# Altium project MB1641.PrjPcb (part 2 of 2)

## Sheet STLINK_V2-1.SCHDOC: STLink V2-1
size A4; Author: Ph.A; SheetNumber: 7; SheetTotal: 8
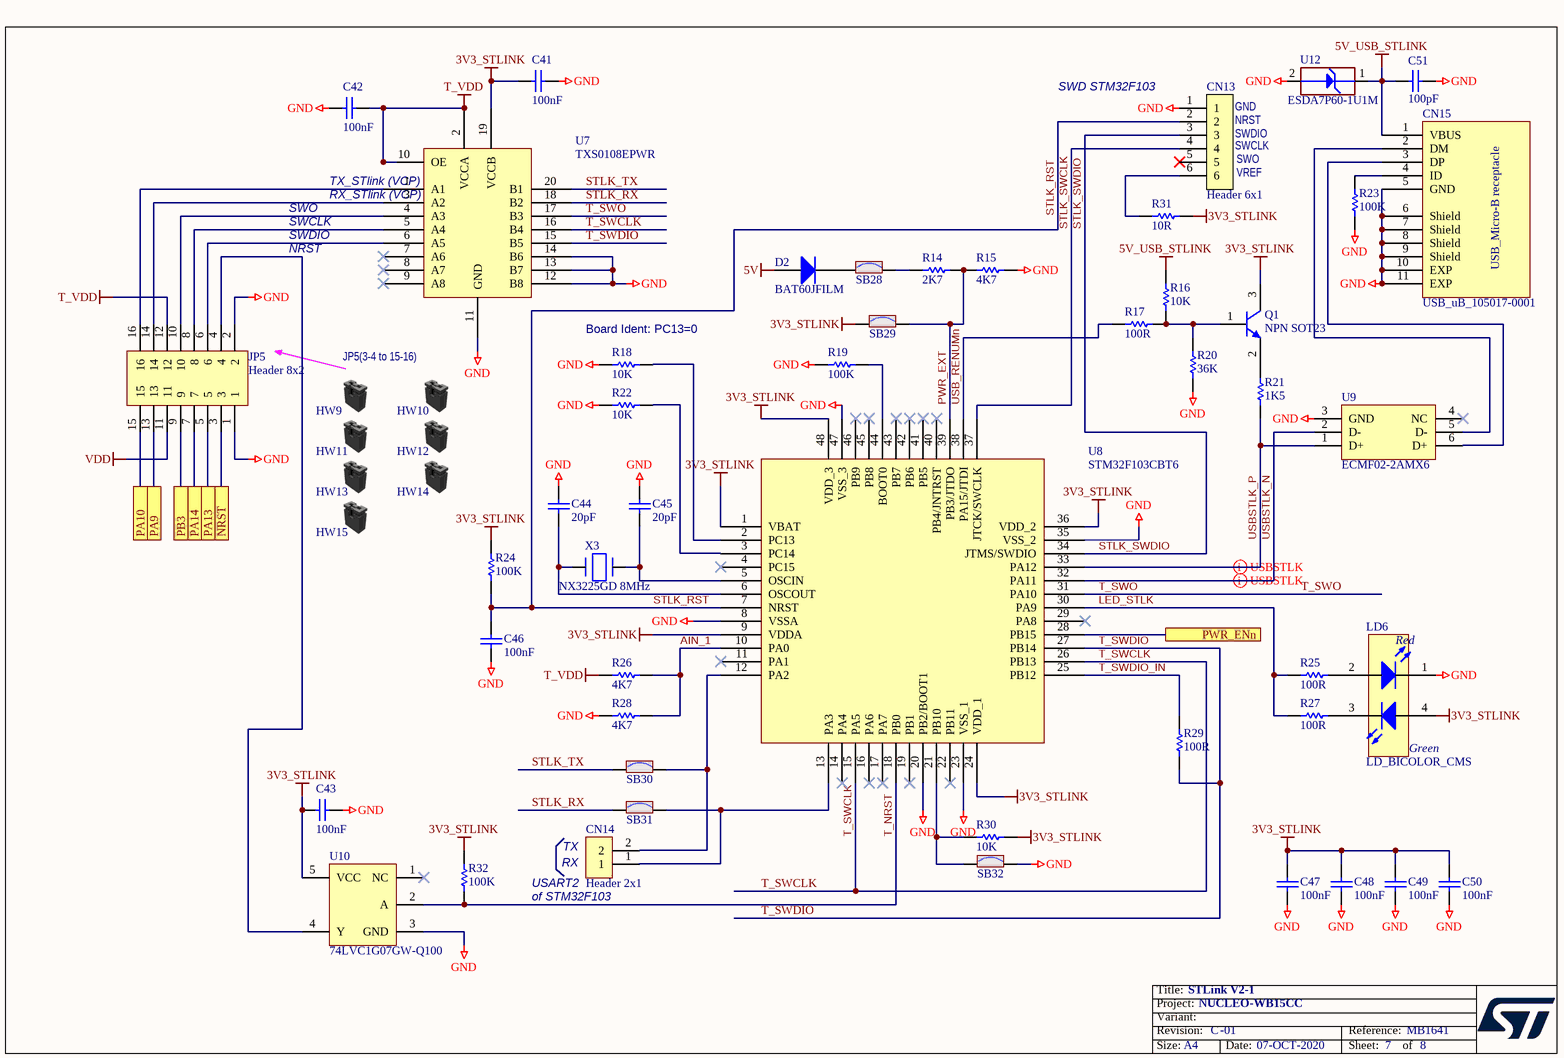
[diagram p4: STLINK_V2-1.SCHDOC]

### Parts
C41  value 100nF  [C0402]  (hidden comment: Capacitor)
C42  value 100nF  [C0402]  (hidden comment: Capacitor)
C43  value 100nF  [C0402]  (hidden comment: Capacitor)
C44  value 20pF  [C0402]  (hidden comment: Capacitor)
C45  value 20pF  [C0402]  (hidden comment: Capacitor)
C46  value 100nF  [C0402]  (hidden comment: Capacitor)
C47  value 100nF  [C0402]  (hidden comment: Capacitor)
C48  value 100nF  [C0402]  (hidden comment: Capacitor)
C49  value 100nF  [C0402]  (hidden comment: Capacitor)
C50  value 100nF  [C0402]  (hidden comment: Capacitor)
C51  value 100pF  [C0402]  (hidden comment: Capacitor)
CN13  Header 6x1  [CON_SAMTEC_TSW-106-07-X-S]
CN14  Header 2x1  [CON_SAMTEC_TSW-102-07-G-S]
CN15  value USB_uB_105017-0001  [CON_USBMICROB_MOLEX_105017-0001_H2P90]  (hidden comment: USB_uB_105017.0001)
D2  BAT60JFILM  [DIO_SOD323]
HW9  Shunt Black 2.54mm  (value not drawn)  (mechanical)
HW10  Shunt Black 2.54mm  (value not drawn)  (mechanical)
HW11  Shunt Black 2.54mm  (value not drawn)  (mechanical)
HW12  Shunt Black 2.54mm  (value not drawn)  (mechanical)
HW13  Shunt Black 2.54mm  (value not drawn)  (mechanical)
HW14  Shunt Black 2.54mm  (value not drawn)  (mechanical)
HW15  Shunt Black 2.54mm  (value not drawn)  (mechanical)
JP5  Header 8x2  [CON_SAMTEC_TSW-108-07-X-D]
LD6  LD_BICOLOR_CMS  [LED_BI-GR_HSMF-A201-A00J1]
Q1  value NPN SOT23  [NPN_SOT23]  (hidden comment: 9013-SOT23)
R14  value 2K7  [R0402]  (hidden comment: Resistor)
R15  value 4K7  [R0402]  (hidden comment: Resistor)
R16  value 10K  [R0402]  (hidden comment: Resistor)
R17  value 100R  [R0402]  (hidden comment: Resistor)
R18  value 10K  [R0402]  (hidden comment: Resistor)
R19  value 100K  [R0402]  (hidden comment: Resistor)
R20  value 36K  [R0402]  (hidden comment: Resistor)
R21  value 1K5  [R0402]  (hidden comment: Resistor)
R22  value 10K  [R0402]  (hidden comment: Resistor)
R23  value 100K  [R0402]  (hidden comment: Resistor)
R24  value 100K  [R0402]  (hidden comment: Resistor)
R25  value 100R  [R0402]  (hidden comment: Resistor)
R26  value 4K7  [R0402]  (hidden comment: Resistor)
R27  value 100R  [R0402]  (hidden comment: Resistor)
R28  value 4K7  [R0402]  (hidden comment: Resistor)
R29  value 100R  [R0402]  (hidden comment: Resistor)
R30  value 10K  [R0402]  (hidden comment: Resistor)
R31  value 10R  [R0402]  (hidden comment: Resistor)
R32  value 100K  [R0402]  (hidden comment: Resistor)
SB28  SB_ON  [SOLDER-BRIDGE_R0402-0R]  (value not drawn)
SB29  SB_ON  [SOLDER-BRIDGE_R0402-0R]  (value not drawn)
SB30  SB_ON  [SOLDER-BRIDGE_R0402-0R]  (value not drawn)
SB31  SB_ON  [SOLDER-BRIDGE_R0402-0R]  (value not drawn)
SB32  SB_ON  [SOLDER-BRIDGE_R0402-0R]  (value not drawn)
U7  TXS0108EPWR  [ICC_TSSOP20_6P50X4P40_P065]
U8  STM32F103CBT6  [ICC_LQFP48_7X7_P050]
U9  ECMF02-2AMX6  [ESD_QFN-6L_1P7X1P5_P050]
U10  74LVC1G07GW-Q100  [ICC_TSSOP5_SOT353-1_2P05X1P25_P065]
U12  value ESDA7P60-1U1M  [ESD_QFN2_1P6X1_P125]  (hidden comment: ESD-TRANSIL)
X3  value NX3225GD 8MHz  [CRY_NX3225GD_2P]  (hidden comment: XTAL_2_PINS)

### Ports
NRST, PA9, PA10, PA13, PA14, PB3, PWR_ENn

### Nets
3V3_STLINK: C41.1 C43.1 C47.2 C48.2 C49.2 C50.2 LD6.4(YellowGreen_anode) Q1.3(C) R24.2 R30.1 R31.2 R32.2 SB29.1 U7.19(VCCB) U8.1(VBAT) U8.9(VDDA) U8.24(VDD_1) U8.36(VDD_2) U8.48(VDD_3) U10.5(VCC)
5V: D2.1(A)
5V_USB_STLINK: C51.1 CN15.1(VBUS) R16.2 U12.1(IO1)
GND: C41.2 C42.1 C43.2 C44.2 C45.2 C46.1 C47.1 C48.1 C49.1 C50.1 C51.2 CN13.1 CN15.5(GND) CN15.6(Shield) CN15.7(Shield) CN15.8(Shield) CN15.9(Shield) CN15.10(EXP) CN15.11(EXP) JP5.1 JP5.2 LD6.1(RED_cathode) R15.2 R18.2 R19.2 R20.1 R22.2 R23.1 R28.1 SB32.2 U7.11(GND) U7.12(B8) U7.13(B7) U7.14(B6) U8.8(VSSA) U8.20(PB2/BOOT1) U8.23(VSS_1) U8.35(VSS_2) U8.47(VSS_3) U9.3(GND) U10.3(GND) U12.2(GND)
T_VDD: C42.2 JP5.12 R26.1 U7.2(VCCA) U7.10(OE)
VDD: JP5.11
AIN_1: R26.2 R28.2 U8.10(PA0)
LED_STLK: R25.1 R27.1 U8.30(PA9)
NRST: JP5.3 ; port NRST
PA9: JP5.13 ; port PA9
PA10: JP5.15 ; port PA10
PA13: JP5.5 ; port PA13
PA14: JP5.7 ; port PA14
PB3: JP5.9 ; port PB3
PWR_ENn: U8.28(PB15) ; port PWR_ENn
PWR_EXT: R14.2 R15.1 SB29.2 U8.39(PB3/JTDO)
STLK_RST: C46.2 CN13.2 R24.1 U8.7(NRST)
STLK_RX: SB31.1 U7.18(B2)
STLK_SWCLK: CN13.4 U8.37(JTCK/SWCLK)
STLK_SWDIO: CN13.3 U8.34(JTMS/SWDIO)
STLK_TX: SB30.1 U7.20(B1)
T_NRST: R32.1 U8.18(PB0) U10.2(A)
T_SWCLK: U7.16(B4) U8.15(PA5) U8.26(PB13)
T_SWDIO: R29.1 U7.15(B5) U8.27(PB14)
T_SWDIO_IN: R29.2 U8.25(PB12)
T_SWO: U7.17(B3) U8.31(PA10)
USB_RENUMn: R17.1 U8.38(PA15/JTDI)
USBSTLK_N: U8.32(PA11) U9.2(D-)
USBSTLK_P: R21.1 U8.33(PA12) U9.1(D+)
NetC44_1: C44.1 U8.6(OSCOUT) X3.1(X1)
NetC45_1: C45.1 U8.5(OSCIN) X3.2(X2)
NetCN13_6: CN13.6 R31.1
NetCN14_1: CN14.1 SB31.2 U8.13(PA3)
NetCN14_2: CN14.2 SB30.2 U8.12(PA2)
NetCN15_2: CN15.2(DM) U9.5(D-)
NetCN15_3: CN15.3(DP) U9.6(D+)
NetCN15_4: CN15.4(ID) R23.2
NetD2_2: D2.2(K) SB28.1
NetJP5_4: JP5.4 U10.4(Y)
NetJP5_6: JP5.6 U7.6(A5)
NetJP5_8: JP5.8 U7.5(A4)
NetJP5_10: JP5.10 U7.4(A3)
NetJP5_14: JP5.14 U7.3(A2)
NetJP5_16: JP5.16 U7.1(A1)
NetLD6_2: LD6.2(Red_anode) R25.2
NetLD6_3: LD6.3(YellowGreen_cathode) R27.2
NetQ1_1: Q1.1(B) R16.1 R17.2 R20.2
NetQ1_2: Q1.2(E) R21.2
NetR14_1: R14.1 SB28.2
NetR18_1: R18.1 U8.2(PC13)
NetR19_1: R19.1 U8.44(BOOT0)
NetR22_1: R22.1 U8.3(PC14)
NetR30_2: R30.2 SB32.1 U8.21(PB10)

Not connected (* = marked no-connect by the designer): CN13 5*; U7 7(A6)* 8(A7)* 9(A8)*; U8 4(PC15)* 11(PA1)* 14(PA4)* 16(PA6)* 17(PA7)* 19(PB1)* 22(PB11)* 29(PA8)* 40(PB4/JNTRST)* 41(PB5)* 42(PB6)* 43(PB7)* 45(PB8)* 46(PB9)*; U9 4(NC)*; U10 1(NC)*

### Layout directives
differential pair; net class DIFF90: USBSTLK_N, USBSTLK_P

### Notes on the sheet
- SWD STM32F103
- (near CN13) SWDIO
- (near CN13) NRST
- (near CN13) GND
- TX_STlink (VCP)
- RX_STlink (VCP)
- (near CN13) SWCLK
- (near CN13) SWO
- (near CN13) VREF
- SWO
- SWCLK
- SWDIO
- NRST
- (near R18) Board Ident: PC13=0
- JP5(3-4 to 15-16)
- (near CN14) RX
- TX
- USART2
- (near CN14) of STM32F103
- Title:
- Project:
- Size:
- Revision:
- Variant:
- A4
- -
- Date:
- Reference:
- Sheet:
- of
- (in symbol MCD-00028) USB_Micro-B receptacle
- (in symbol MCD-00051) Red; Green

### Library data of the parts
C41-C43 C46-C50 = MCD-00006: Capacitor, MLCC, 100nF, 16V, X7R, +/-10%, 0402, T=0.5mm; Manufacturer_Part_Number: CC0402KRX7R7BB104; Manufacturer: YAGEO; Alternate_Manufacturer_Part_Number: GCM155R71C104KA55D; Alternate_Manufacturer: MURATA; Part_Preference: Recommended; Order_Code_RS: 616-9701; Internal_Part_Number: MCD-00006; Status: Released; Part_Type: Capacitor; Package: C0402; ComponentLink1URL: http://tunmcdsvn.tun.st.com/Component_Datasheet_Library/Trunk/Capacitors/Yageo_Multilayer_Capacitor_X7R_series_100pF_to_22uF; Order_Code_Digikey: 311-1338-1-ND; Order_Code_Farnell: 9402047
C44 C45 = MCD-00016: Capacitor, MLCC, 20pF, 50V, NPO, +/- 5%, 0402, T=0,5mm; Manufacturer_Part_Number: CC0402JRNPO9BN200; Manufacturer: YAGEO; Part_Preference: Recommended; Internal_Part_Number: MCD-00016; Status: Released; Part_Type: Capacitor; Package: C0402; ComponentLink1URL: http://tunmcdsvn.tun.st.com/Component_Datasheet_Library/Trunk/Capacitors/Yageo_Capacitor_NP0_16V-to-50V; Order_Code_Digikey: 311-1417-1-ND; Order_Code_Farnell: N/A; Order_Code_RS: N/A
C51 = MCD-00205: Capacitor,MLCC,100pF,50V,NPO,+/-5%,0402,T=0,5mm; Manufacturer_Part_Number: CC0402JRNPO9BN101; Manufacturer: YAGEO; Part_Preference: Recommended; Internal_Part_Number: MCD-00205; Status: Released; Part_Type: Capacitor; Package: C0402; ComponentLink1URL: http://tunmcdsvn.tun.st.com/Component_Datasheet_Library/Trunk/Capacitors/Yageo_Capacitor_NP0_16V-to-50V; Order_Code_Digikey: 311-1024-1-ND; Order_Code_Farnell: 3019226RL; Order_Code_RS: N/A
CN13 = MCD-00212: Header, 6x1, 2,54mm, VR, TH, Height 5.84mm/2.54mm; Part_Type: Connector; Manufacturer_Part_Number: TSW-106-07-G-S; Manufacturer: SAMTEC; Part_Preference: Recommended; Internal_Part_Number: MCD-00212; Value: Header 6x1; Status: Released; ComponentLink1URL: http://tunmcdsvn.tun.st.com/Component_Datasheet_Library/Trunk/Connectors/Samtec_TSW-HTSW-series
CN14 = MCD-00032: Header, 2x1, 2,54mm, VR, TH, Height 5.84mm/2.54mm; Manufacturer_Part_Number: TSW-102-07-G-S; Manufacturer: SAMTEC; Part_Type: Connector; Part_Preference: Recommended; Alternate_Manufacturer: JIUBABA; Alternate_Manufacturer_Part_Number: 313102S111116; Internal_Part_Number: MCD-00032; Value: Header 2x1; Status: Released; ComponentLink1URL: http://tunmcdsvn.tun.st.com/Component_Datasheet_Library/Trunk/Connectors/Samtec_TSW-HTSW-series
CN15 = MCD-00028: USB-MICRO-B, 0.65mm, RA, SMT, Bottom Mount,; Part_Type: Connector; Manufacturer_Part_Number: 1050170001; Manufacturer: MOLEX; Part_Preference: Recommended; Internal_Part_Number: MCD-00028; Status: Released; ComponentLink1URL: http://tunmcdsvn.tun.st.com/Component_Datasheet_Library/Trunk/Connectors/Molex_Connector-USB-microB_105017-0001
D2 = MCD-00034: Manufacturer: STMICROELECTRONICS; Part_Type: Diode; BMS_Part_Number: 9151097; Part_Preference: Recommended; Manufacturer_HQ_COO: EU; Internal_Part_Number: MCD-00034; Value: BAT60JFILM; Manufacturer_Part_Number: BAT60JFILM; Status: Released; ComponentLink1URL: http://tunmcdsvn.tun.st.com/Component_Datasheet_Library/Trunk/Diodes/STM_Diode_BAT60JFILM-SOD323
HW9-HW15 = MCD-00043: SHUNT 2.54mm BLACK; Manufacturer_Part_Number: SNT-100-BK-G; Manufacturer: SAMTEC; Part_Type: Misc; Part_Preference: Recommended; Alternate_Manufacturer: JIUBABA; Alternate_Manufacturer_Part_Number: 316102S111A; Value: SNT-100-BK-G; Internal_Part_Number: MCD-00043; Status: Released; ComponentLink1URL: http://tunmcdsvn.tun.st.com/Component_Datasheet_Library/Trunk/Connectors/Samtec_Shunt_Jumper_SNT100
JP5 = MCD-02061: Header, 8x2, 2,54mm, VR, TH, Height 5.84mm/2.54mm; Part_Type: Connector; Manufacturer_Part_Number: TSW-108-07-G-D; Manufacturer: SAMTEC; Part_Preference: Recommended; Order_Code_RS: 161-2292; Internal_Part_Number: MCD-02061; Value: Header 8x2; Status: Checked; ComponentLink1URL: http://tunmcdsvn.tun.st.com/Component_Datasheet_Library/Trunk/Connectors/Samtec_TSW-HTSW-series; Alternate_Manufacturer: N/A; Alternate_Manufacturer_Part_Number: N/A; Package: N/A; Order_Code_Digikey: SAM1028-08-ND; Order_Code_Farnell: 2578721
LD6 = MCD-00051: LED Bicolor; Part_Type: Display; Manufacturer_Part_Number: HSMF-A201-A00J1; Manufacturer: AVAGO TECHNOLOGIES; Alternate_Manufacturer_Part_Number: LE-RGW35280; Alternate_Manufacturer: EVERLUCK; Part_Preference: Forbidden; Internal_Part_Number: MCD-00051; Value: LD_BICOLOR_CMS; Status: Released; ComponentLink1URL: http://tunmcdsvn.tun.st.com/Component_Datasheet_Library/Trunk/Display/Avago_LED-SMC_HSMx-A2xx-02Feb2012
Q1 = MCD-00073: NPN Bipolar Transistor; Manufacturer_Part_Number: BSR14; Manufacturer: ON SEMICONDUCTOR; Part_Type: IC; Part_Preference: Recommended; Alternate_Manufacturer_Part_Number: MMBT2222LT1G / MMBT2222ALT1G / MMBT2222ALT3G; Revision: *; Internal_Part_Number: MCD-00073; Status: Released; Alternate_Manufacturer: ON SEMICONDUCTOR; Package: SOT23; ComponentLink1URL: http://tunmcdsvn.tun.st.com/Component_Datasheet_Library/Trunk/IC/NXP_Transistor_BSR14
R14 = MCD-00055: Resistor,2K7,0402,1%,1/16W; Manufacturer_Part_Number: RC0402FR-072K7L; Manufacturer: YAGEO; Part_Preference: Recommended; Internal_Part_Number: MCD-00055; Status: Released; Part_Type: Resistor; Package: R0402; ComponentLink1URL: http://tunmcdsvn.tun.st.com/Component_Datasheet_Library/Trunk/Resistors/Yageo_Resistor_RC0402-series; Order_Code_Digikey: 311-2.70KLRCT-ND; Order_Code_Farnell: 9239286; Order_Code_RS: N/A
R15 R26 R28 = MCD-00065: Resistor,4K7,0402,1%,1/16W; Manufacturer_Part_Number: RC0402FR-074K7L; Manufacturer: YAGEO; Alternate_Manufacturer_Part_Number: RT0402FRE074K7L; Part_Preference: Recommended; Internal_Part_Number: MCD-00065; Status: Released; Part_Type: Resistor; Alternate_Manufacturer: YAGEO; Package: R0402; ComponentLink1URL: http://tunmcdsvn.tun.st.com/Component_Datasheet_Library/Trunk/Resistors/Yageo_Resistor_RC0402-series; Order_Code_Digikey: 311-4.7KLRCT-ND; Order_Code_Farnell: 9239316; Order_Code_RS: N/A
R16 R18 R22 R30 = MCD-00053: Resistor,10K,0402,1%,1/16W; Manufacturer_Part_Number: RC0402FR-0710KL; Manufacturer: YAGEO; BMS_Part_Number: 9131590; Part_Preference: Recommended; Internal_Part_Number: MCD-00053; Status: Released; Part_Type: Resistor; Package: R0402; ComponentLink1URL: http://tunmcdsvn.tun.st.com/Component_Datasheet_Library/Trunk/Resistors/Yageo_Resistor_RC0402-series; Order_Code_Digikey: 311-10.0KLRCT-ND; Order_Code_Farnell: 9239359; Order_Code_RS: N/A
R17 R25 R27 R29 = MCD-00067: Resistor,100R,0402,1%,1/16W; Manufacturer_Part_Number: RC0402FR-07100RL; Manufacturer: YAGEO; Part_Preference: Recommended; Internal_Part_Number: MCD-00067; Status: Released; Part_Type: Resistor; Package: R0402; ComponentLink1URL: http://tunmcdsvn.tun.st.com/Component_Datasheet_Library/Trunk/Resistors/Yageo_Resistor_RC0402-series; Order_Code_Digikey: 311-100LRCT-ND; Order_Code_Farnell: 9239111; Order_Code_RS: N/A
R19 R23 R24 R32 = MCD-00059: Resistor,100K,0402,1%,1/16W; Manufacturer_Part_Number: RC0402FR-07100KL; Manufacturer: YAGEO; Alternate_Manufacturer_Part_Number: RT0402FRE07100KL; Part_Preference: Recommended; Internal_Part_Number: MCD-00059; Status: Released; Part_Type: Resistor; Alternate_Manufacturer: YAGEO; Package: R0402; ComponentLink1URL: http://tunmcdsvn.tun.st.com/Component_Datasheet_Library/Trunk/Resistors/Yageo_Resistor_RC0402-series; Order_Code_Digikey: 311-100KLRTR-ND; Order_Code_Farnell: 2421891; Order_Code_RS: N/A
R20 = MCD-00069: Resistor,36K,0402,1%,1/16W; Manufacturer_Part_Number: RC0402FR-0736KL; Manufacturer: YAGEO; Part_Preference: Recommended; Internal_Part_Number: MCD-00069; Status: Released; Part_Type: Resistor; Package: R0402; ComponentLink1URL: http://tunmcdsvn.tun.st.com/Component_Datasheet_Library/Trunk/Resistors/Yageo_Resistor_RC0402-series; Order_Code_Digikey: 311-36.0KLRCT-ND; Order_Code_Farnell: 1458788; Order_Code_RS: N/A
R21 = MCD-00068: Resistor,1K5,0402,1%,1/16W; Manufacturer_Part_Number: RC0402FR-071K5L; Manufacturer: YAGEO; Part_Preference: Recommended; Internal_Part_Number: MCD-00068; Status: Released; Part_Type: Resistor; Package: R0402; ComponentLink1URL: http://tunmcdsvn.tun.st.com/Component_Datasheet_Library/Trunk/Resistors/Yageo_Resistor_RC0402-series; Order_Code_Digikey: 311-1.50KLRCT-ND; Order_Code_Farnell: 9239251; Order_Code_RS: N/A
R31 = MCD-00358: Resistor,10R,0402,1%,1/16W; Manufacturer_Part_Number: RC0402FR-0710RL; Manufacturer: YAGEO; Part_Preference: Recommended; Order_Code_RS: 618-5848; Internal_Part_Number: MCD-00358; Status: Released; Part_Type: Resistor; Package: R0402; ComponentLink1URL: http://tunmcdsvn.tun.st.com/Component_Datasheet_Library/Trunk/Resistors/Yageo_Resistor_RC0402-series; Order_Code_Digikey: 311-10.0LRCT-ND; Order_Code_Farnell: 9238999
SB28-SB32 = MCD-01618: Solder Bridge 0402 ON; Part_Type: Misc; Manufacturer_Part_Number: RC0402JR-070RL; Manufacturer: YAGEO; Part_Preference: Recommended; Order_Code_RS: 618-5804; Internal_Part_Number: MCD-01618; Status: Released; Package: SB0402; ComponentLink1URL: http://tunmcdsvn.tun.st.com/Component_Datasheet_Library/Trunk/Resistors/Yageo_Resistor_RC0402-series; Order_Code_Digikey: 311-0.0JRTR-ND; Order_Code_Farnell: 2363467
U7 = MCD-00289: 8bits_bidirectionnal level shifter, Delay 312ns/1V8; Part_Type: IC; Manufacturer: TEXAS INSTRUMENTS; Part_Preference: Recommended; Internal_Part_Number: MCD-00289; Value: TXS0108EPWR; Status: Released; Manufacturer_Part_Number: TXS0108EPWR; ComponentLink1URL: http://tunmcdsvn.tun.st.com/Component_Datasheet_Library/Trunk/IC/TI_8bits_level_shifter_bidir_TXS0108E
U8 = MCD-00085: Medium-density performance line ARM-based 32-bit MCU with 128KB Flash; Part_Type: IC; Manufacturer: STMICROELECTRONICS; BMS_Part_Number: 9175111; Part_Preference: Recommended; Manufacturer_HQ_COO: EU; Internal_Part_Number: MCD-00085; Value: STM32F103CBT6; Status: Released; Manufacturer_Part_Number: STM32F103CBT6; ComponentLink1URL: http://tunmcdsvn.tun.st.com/Component_Datasheet_Library/Trunk/IC/STM_STM32F103CBT6
U9 = MCD-00649: Common mode filter with ESD protection for USB 2.0 interface; Part_Type: Diode; Manufacturer: STMICROELECTRONICS; BMS_Part_Number: 9151138; Part_Preference: Recommended; Manufacturer_HQ_COO: EU; Internal_Part_Number: MCD-00649; Value: ECMF02-2AMX6; Status: Released; Manufacturer_Part_Number: ECMF02-2AMX6; ComponentLink1URL: http://tunmcdsvn.tun.st.com/Component_Datasheet_Library/Trunk/Diodes/STM_ESD_ECMF02-2AMX6
U10 = MCD-01960: Buffer/Driver 1-CH Non-Inverting Open Drain CMOS Automotive 5-Pin TSSOP T/R; Part_Type: IC; Manufacturer: NEXPERIA; Part_Preference: Recommended; Value: Buffer/Driver 1-CH; Status: Released; ComponentLink1URL: http://tunmcdsvn.tun.st.com/Component_Datasheet_Library/Trunk/IC/NEXPERIA_74LVC1G07GW-Q100; Internal_Part_Number: MCD-01960; Manufacturer_Part_Number: 74LVC1G07GW-Q100; Package: TSSOP5
U12 = MCD-00251: High power transient voltage suppressor, 7V breakdown; Part_Type: Diode; Manufacturer: STMICROELECTRONICS; BMS_Part_Number: 9179042; Part_Preference: Recommended; Manufacturer_HQ_COO: EU; Internal_Part_Number: MCD-00251; Status: Released; Manufacturer_Part_Number: ESDA7P60-1U1M; ComponentLink1URL: http://tunmcdsvn.tun.st.com/Component_Datasheet_Library/Trunk/Diodes/STM_ESD_ESDA7P60-1U1M
X3 = MCD-00092: Crystal 8MHz, 8pF, +-20ppm, 500ohms max,  SMD; Part_Type: Crystal oscillator; Manufacturer_Part_Number: NX3225GD 8MHz EXS00A-CG04874; Manufacturer: NDK; BMS_Part_Number: 9157029; Part_Preference: Recommended; Internal_Part_Number: MCD-00092; Status: Released; ComponentLink1URL: http://tunmcdsvn.tun.st.com/Component_Datasheet_Library/Trunk/Crystal_Osc/NDK_Crystal-For-ST_NX3225GD 8MHz EXS00A-CG04874 (EXS10B-20725); Order_Code_Digikey: 644-1391

## Sheet HW_Mechanical_Parts.SchDoc: Mechanical parts
size A4; Date: Not used; ApprovedBy: Not used; CheckedBy: Not used; Author: Not used; CompanyName: STMicroelectronics; DrawnBy: Not used; Engineer: Not used; Organization: Not used; Address1: Not used; Address2: Not used; Address3: Not used; Address4: Not used; DocumentNumber: Not used; Revision: Not used; SheetNumber: 8; SheetTotal: 8; CurrentTime: Not used; CurrentDate: Not used; Time: Not used; DocumentFullPathAndName: Not used; DocumentName: Not used; ModifiedDate: Not used; ImagePath: Not used; ProjectName: Not used; Application_BuildNumber: Not used
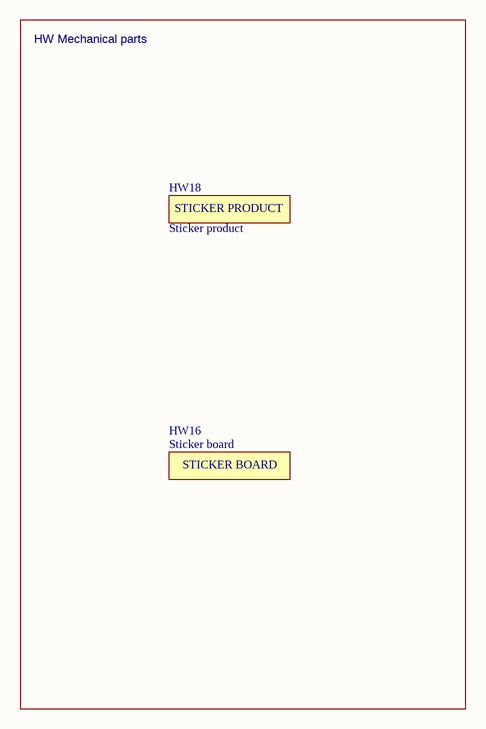
[diagram p5: HW_Mechanical_Parts.SchDoc]

### Parts
HW16  value Sticker board  [STICKER_BOARD_25X9]  (hidden comment: STICKER_BOARD)  (no BOM)
HW18  value Sticker product  [STICKER_PRODUCT_25X9]  (hidden comment: STICKER_PRODUCT)  (no BOM)

### Blocks framed on the sheet
HW Mechanical parts: HW16 HW18

### Notes on the sheet
- Title:
- Project:
- Size:
- Revision:
- Variant:
- A4
- -
- Date:
- Reference:
- Sheet:
- of
- (in symbol MCD-00235) STICKER BOARD
- (in symbol MCD-00547) STICKER PRODUCT

### Library data of the parts
HW16 = MCD-00235: Sticker Board 25x9 mm; Part_Type: Misc; Part_Preference: Recommended; Internal_Part_Number: MCD-00235; Status: Released; Manufacturer_Part_Number: N/A; Manufacturer: N/A; ComponentLink1URL: N/A; Alternate_Manufacturer: N/A; Alternate_Manufacturer_Part_Number: N/A; Package: N/A; Order_Code_Digikey: N/A; Order_Code_Farnell: N/A; Order_Code_RS: N/A
HW18 = MCD-00547: Sticker product 25x9 mm; Part_Type: Misc; Part_Preference: Recommended; Internal_Part_Number: MCD-00547; Status: Released; Manufacturer_Part_Number: N/A; Manufacturer: N/A; ComponentLink1URL: N/A; Alternate_Manufacturer: N/A; Alternate_Manufacturer_Part_Number: N/A; Package: N/A; Order_Code_Digikey: N/A; Order_Code_Farnell: N/A; Order_Code_RS: N/A

## Sheet Arduino_Mopho_Connectors.SchDoc: Arduino/Morphos extension connectors
size A4; Author: Ph.A; SheetNumber: 5; SheetTotal: 8
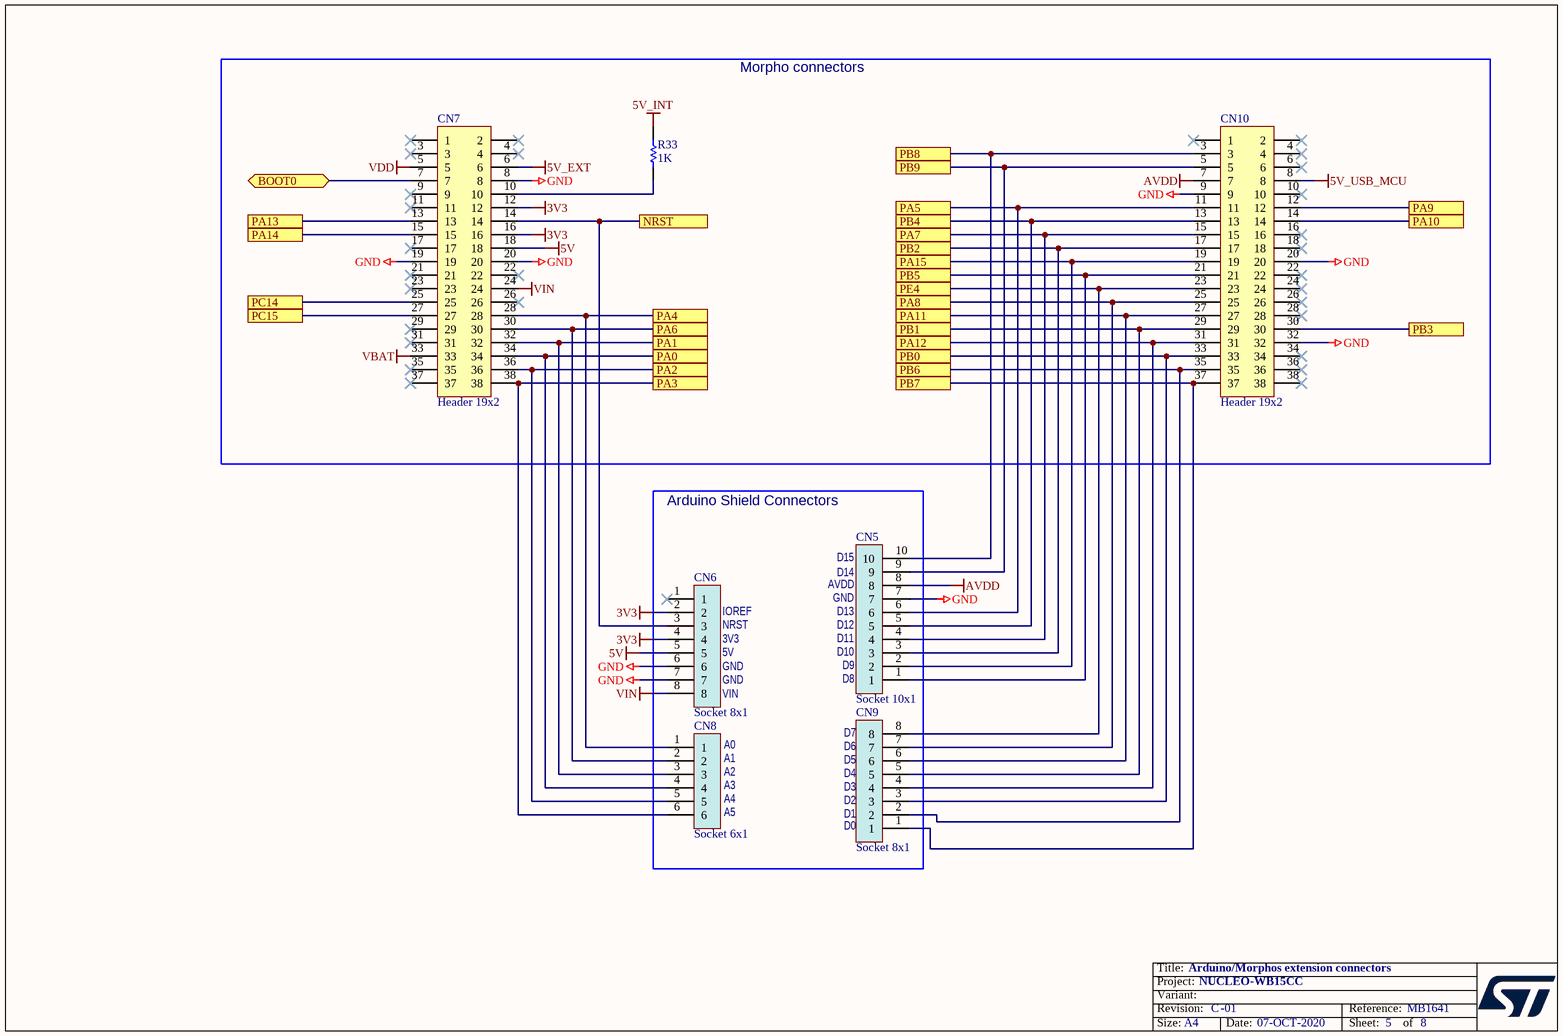
[diagram p6: Arduino_Mopho_Connectors.SchDoc]

### Parts
CN5  Socket 10x1  [CON_SAMTEC_SSW-110-01-X-S]
CN6  Socket 8x1  [CON_SAMTEC_SSW-108-01-X-S]
CN7  Header 19x2  [CON_SAMTEC_TSW-119-09-X-D]
CN8  Socket 6x1  [CON_SAMTEC_SSW-106-01-X-S]
CN9  Socket 8x1  [CON_SAMTEC_SSW-108-01-X-S]
CN10  Header 19x2  [CON_SAMTEC_TSW-119-09-X-D]
R33  value 1K  [R0402]  (hidden comment: Resistor)

### Blocks framed on the sheet
Morpho connectors: CN7 CN10 R33
Arduino Shield Connectors: CN5 CN6 CN8 CN9

### Ports
BOOT0 (bidir), NRST, PA0, PA1, PA2, PA3, PA4, PA5, PA6, PA7, PA8, PA9, PA10, PA11, PA12, PA13, PA14, PA15, PB0, PB1, PB2, PB3, PB4, PB5, PB6, PB7, PB8, PB9, PC14, PC15, PE4

### Nets
3V3: CN6.2 CN6.4 CN7.12 CN7.16
5V: CN6.5 CN7.18
5V_EXT: CN7.6
5V_INT: R33.2
5V_USB_MCU: CN10.8
AVDD: CN5.8 CN10.7
GND: CN5.7 CN6.6 CN6.7 CN7.8 CN7.19 CN7.20 CN10.9 CN10.20 CN10.32
VBAT: CN7.33
VDD: CN7.5
VIN: CN6.8 CN7.24
BOOT0: CN7.7 ; port BOOT0
NRST: CN6.3 CN7.14 ; port NRST
PA0: CN7.34 CN8.4 ; port PA0
PA1: CN7.32 CN8.3 ; port PA1
PA2: CN7.36 CN8.5 ; port PA2
PA3: CN7.38 CN8.6 ; port PA3
PA4: CN7.28 CN8.1 ; port PA4
PA5: CN5.6 CN10.11 ; port PA5
PA6: CN7.30 CN8.2 ; port PA6
PA7: CN5.4 CN10.15 ; port PA7
PA8: CN9.7 CN10.25 ; port PA8
PA9: CN10.12 ; port PA9
PA10: CN10.14 ; port PA10
PA11: CN9.6 CN10.27 ; port PA11
PA12: CN9.4 CN10.31 ; port PA12
PA13: CN7.13 ; port PA13
PA14: CN7.15 ; port PA14
PA15: CN5.2 CN10.19 ; port PA15
PB0: CN9.3 CN10.33 ; port PB0
PB1: CN9.5 CN10.29 ; port PB1
PB2: CN5.3 CN10.17 ; port PB2
PB3: CN10.30 ; port PB3
PB4: CN5.5 CN10.13 ; port PB4
PB5: CN5.1 CN10.21 ; port PB5
PB6: CN9.2 CN10.35 ; port PB6
PB7: CN9.1 CN10.37 ; port PB7
PB8: CN5.10 CN10.3 ; port PB8
PB9: CN5.9 CN10.5 ; port PB9
PC14: CN7.25 ; port PC14
PC15: CN7.27 ; port PC15
PE4: CN9.8 CN10.23 ; port PE4
NetCN7_10: CN7.10 R33.1

Not connected (* = marked no-connect by the designer): CN6 1*; CN7 1* 2* 3* 4* 9* 11* 17* 21* 22* 23* 26* 29* 31* 35* 37*; CN10 1* 2* 4* 6* 10* 16* 18* 22* 24* 26* 28* 34* 36* 38*

### Notes on the sheet
- (near CN5) D14
- (near CN5) D15
- (near CN6) 3V3
- (near CN6) NRST
- (near CN6) IOREF
- (near CN5) AVDD
- (near CN5) GND
- (near CN5) D10
- (near CN5) D11
- (near CN5) D12
- (near CN5) D13
- (near CN6) GND
- (near CN6) VIN
- (near CN6) 5V
- (near CN5) D9
- (near CN5) D8
- (near CN8) A0
- (near CN8) A1
- (near CN8) A2
- (near CN8) A3
- (near CN9) D3
- (near CN9) D4
- (near CN9) D5
- (near CN9) D6
- (near CN9) D7
- (near CN8) A5
- (near CN8) A4
- (near CN9) D0
- (near CN9) D1
- (near CN9) D2
- Title:
- Project:
- Size:
- Revision:
- Variant:
- -
- Date:
- Reference:
- Sheet:
- of

### Library data of the parts
CN5 = MCD-02080: Socket 10x1, 2.54mm, VR, TH, height 8.51/2.64mm; Part_Type: Connector; Manufacturer_Part_Number: SSW-110-01-G-S; Manufacturer: SAMTEC; Alternate_Manufacturer_Part_Number: 218110S16198; Alternate_Manufacturer: JIUBABA; Part_Preference: Recommended; Order_Code_RS: 765-5736; Internal_Part_Number: MCD-02080; Status: Checked; ComponentLink1URL: http://tunmcdsvn.tun.st.com/Component_Datasheet_Library/Trunk/Connectors/Samtec_SSW-SSQ-series/Samtec_SSW-SSQ-series.pdf; Value: Socket 10x1; Package: N/A; Order_Code_Digikey: SSW-110-01-G-S-LL-ND; Order_Code_Farnell: 1668374
CN6 CN9 = MCD-01743: Socket 8x1, 2.54mm, VR, TH, height 8.51/2.64mm; Part_Type: Connector; Manufacturer_Part_Number: SSW-108-01-G-S; Manufacturer: SAMTEC; Alternate_Manufacturer_Part_Number: 988.08.18.2.00050 (218108S16198); Alternate_Manufacturer: Jiubaba; Part_Preference: Recommended; Internal_Part_Number: MCD-01743; Value: Socket 8x1; Status: Released; ComponentLink1URL: http://tunmcdsvn.tun.st.com/Component_Datasheet_Library/Trunk/Connectors/Samtec_SSW-SSQ-series/Samtec_SSW-SSQ-series.pdf
CN7 CN10 = MCD-00213: Header, 19x2, 2,54mm, VR, TH, Height 5.84mm/10.16mm; Part_Type: Connector; Manufacturer_Part_Number: TSW-119-09-G-D; Manufacturer: SAMTEC; Part_Preference: Recommended; Internal_Part_Number: MCD-00213; Value: Header 19x2; Status: Released; ComponentLink1URL: http://tunmcdsvn.tun.st.com/Component_Datasheet_Library/Trunk/Connectors/Samtec_TSW-HTSW-series
CN8 = MCD-02079: Socket 6x1, 2.54mm, VR, TH, height 8.51/2.64mm; Part_Type: Connector; Manufacturer_Part_Number: SSW-106-01-G-S; Manufacturer: SAMTEC; Alternate_Manufacturer_Part_Number: 218106S16198; Alternate_Manufacturer: JIUBABA; Part_Preference: Recommended; Order_Code_RS: 765-5666; Internal_Part_Number: MCD-02079; Status: Checked; ComponentLink1URL: http://tunmcdsvn.tun.st.com/Component_Datasheet_Library/Trunk/Connectors/Samtec_SSW-SSQ-series/Samtec_SSW-SSQ-series.pdf; Value: Socket 6x1; Package: N/A; Order_Code_Digikey: SSW-106-01-G-S-LL-ND; Order_Code_Farnell: 1668352
R33 = MCD-00061: Resistor,1K,0402,1%,1/16W; Manufacturer_Part_Number: RC0402FR-071KL; Manufacturer: YAGEO; Part_Preference: Recommended; Internal_Part_Number: MCD-00061; Status: Released; Part_Type: Resistor; Package: R0402; ComponentLink1URL: http://tunmcdsvn.tun.st.com/Component_Datasheet_Library/Trunk/Resistors/Yageo_Resistor_RC0402-series; Order_Code_Digikey: 311-1.00KLRCT-ND; Order_Code_Farnell: 9239235; Order_Code_RS: N/A

## Sheet STM32_microcontroller_IOs.SchDoc: STM32 microcontroller I/Os
size A4; Author: Ph.A; SheetNumber: 3; SheetTotal: 8
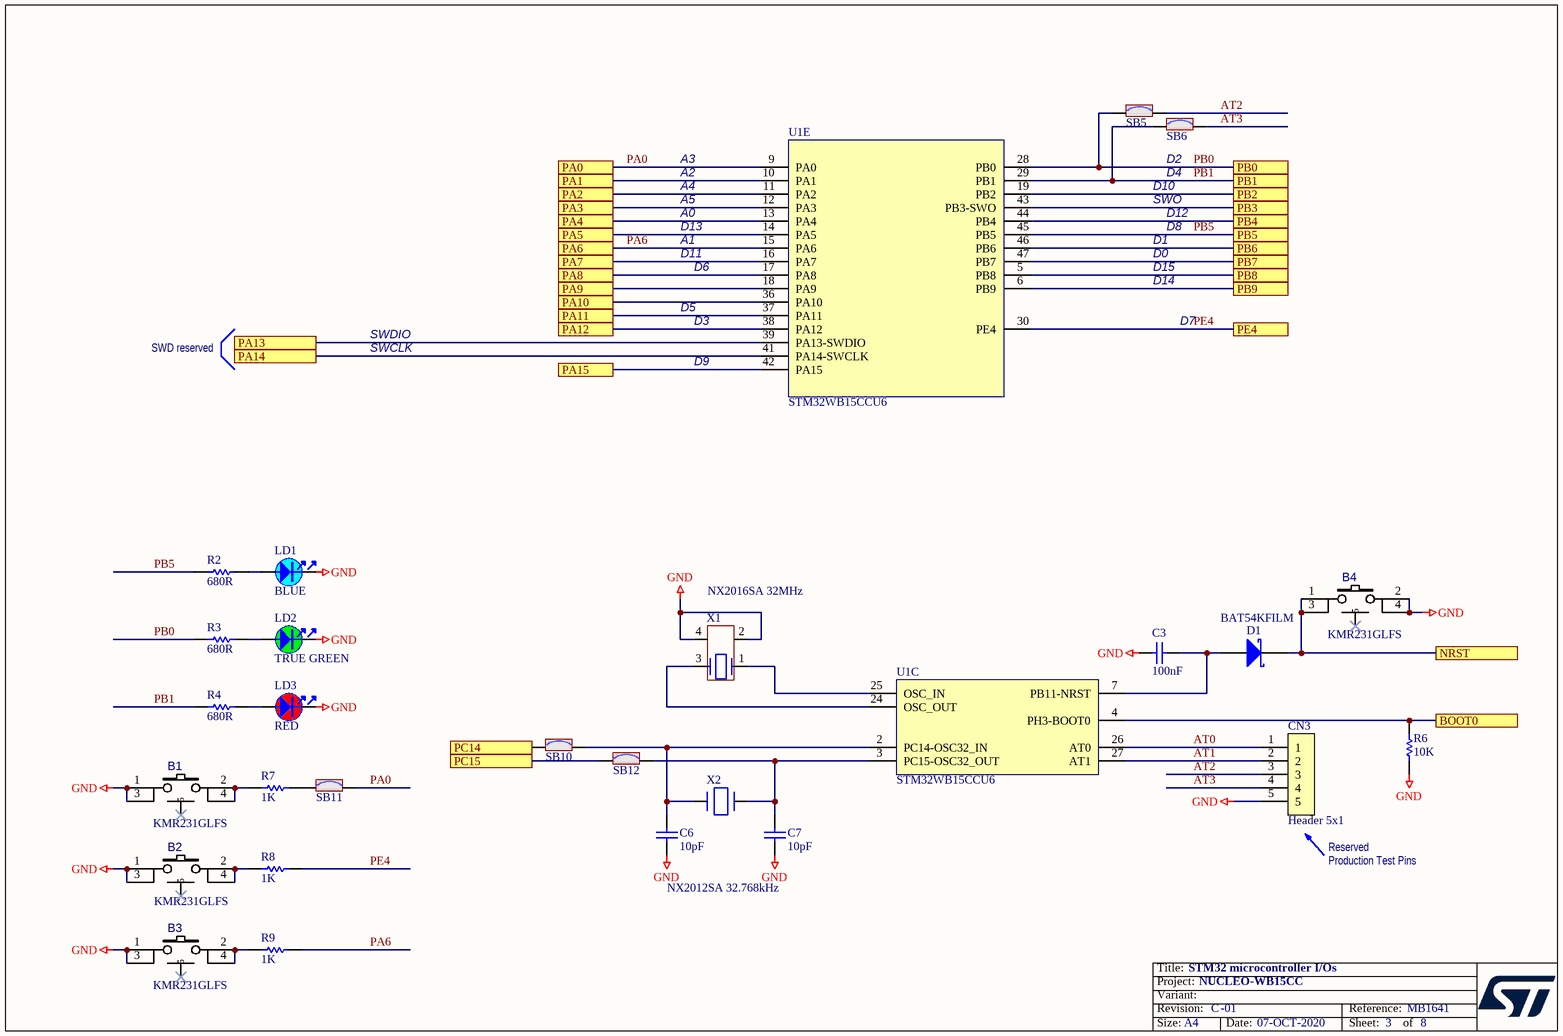
[diagram p7: STM32_microcontroller_IOs.SchDoc]

### Parts
B1  value KMR231GLFS  [SWI_C&K_Y78B23110FP__ITT_KMR231GLFS]  (hidden comment: SW-PUSH-CMS_KMR2_BLACK)
B2  value KMR231GLFS  [SWI_C&K_Y78B23110FP__ITT_KMR231GLFS]  (hidden comment: SW-PUSH-CMS_KMR2_BLACK)
B3  value KMR231GLFS  [SWI_C&K_Y78B23110FP__ITT_KMR231GLFS]  (hidden comment: SW-PUSH-CMS_KMR2_BLACK)
B4  value KMR231GLFS  [SWI_C&K_Y78B23110FP__ITT_KMR231GLFS]  (hidden comment: SW-PUSH-CMS_KMR2_BLACK)
C3  value 100nF  [C0402]  (hidden comment: Capacitor)
C6  value 10pF  [C0402]  (hidden comment: Capacitor)
C7  value 10pF  [C0402]  (hidden comment: Capacitor)
CN3  Header 5x1  [CON_SAMTEC_TSW-105-07-X-S]
D1  value BAT54KFILM  [DIO_SOD523_1A_2K]  (hidden comment: SCHOTTKY_1A_2K)
LD1  value BLUE  [LED_0603_VISHAY_VLMB1300-GS08_BLUE_1A2K_H0P8]  (hidden comment: LED_blue)
LD2  value TRUE GREEN  [LED_0603_VISHAY_VLMTG1300-GS08_GREEN_1A2K_H0P8]  (hidden comment: LED_green)
LD3  value RED  [LED_0603_VISHAY_VLMS1300-GS08_RED_1A2K_H0P8]  (hidden comment: LED_red)
R2  value 680R  [R0402]  (hidden comment: Resistor)
R3  value 680R  [R0402]  (hidden comment: Resistor)
R4  value 680R  [R0402]  (hidden comment: Resistor)
R6  value 10K  [R0402]  (hidden comment: Resistor)
R7  value 1K  [R0402]  (hidden comment: Resistor)
R8  value 1K  [R0402]  (hidden comment: Resistor)
R9  value 1K  [R0402]  (hidden comment: Resistor)
SB5  SB_ON  [SOLDER-BRIDGE_R0402-0R]  (value not drawn)
SB6  SB_ON  [SOLDER-BRIDGE_R0402-0R]  (value not drawn)
SB10  SB_ON  [SOLDER-BRIDGE_R0402-0R]  (value not drawn)
SB11  SB_ON  [SOLDER-BRIDGE_R0402-0R]  (value not drawn)
SB12  SB_ON  [SOLDER-BRIDGE_R0402-0R]  (value not drawn)
U1  value STM32WB15CCU6  [ICC_UFQFPN48-EPAD_7X7_H0P55_P050]  (hidden comment: STM32WB15_QFN48)  (parts C,E of 5)
X1  value NX2016SA 32MHz  [CRY_NX2016SA_4P]  (hidden comment: XTAL_4_PINS)
X2  value NX2012SA 32.768kHz  [CRY_NX2012SA_2P]  (hidden comment: XTAL_2_PINS)

### Ports
BOOT0, NRST, PA0, PA1, PA2, PA3, PA4, PA5, PA6, PA7, PA8, PA9, PA10, PA11, PA12, PA13, PA14, PA15, PB0, PB1, PB2, PB3, PB4, PB5, PB6, PB7, PB8, PB9, PC14, PC15, PE4

### Nets
GND: B1.1 B1.3 B2.1 B2.3 B3.1 B3.3 B4.2 B4.4 C3.1 C6.1 C7.1 CN3.5 LD1.2 LD2.2 LD3.2 R6.1 X1.2 X1.4
AT0: CN3.1 U1.26(AT0)
AT1: CN3.2 U1.27(AT1)
AT2: CN3.3 SB5.2
AT3: CN3.4 SB6.2
BOOT0: R6.2 U1.4(PH3-BOOT0) ; port BOOT0
NRST: B4.1 B4.3 D1.2(K) ; port NRST
PA0: SB11.2 U1.9(PA0) ; port PA0
PA1: U1.10(PA1) ; port PA1
PA2: U1.11(PA2) ; port PA2
PA3: U1.12(PA3) ; port PA3
PA4: U1.13(PA4) ; port PA4
PA5: U1.14(PA5) ; port PA5
PA6: R9.2 U1.15(PA6) ; port PA6
PA7: U1.16(PA7) ; port PA7
PA8: U1.17(PA8) ; port PA8
PA9: U1.18(PA9) ; port PA9
PA10: U1.36(PA10) ; port PA10
PA11: U1.37(PA11) ; port PA11
PA12: U1.38(PA12) ; port PA12
PA13: U1.39(PA13-SWDIO) ; port PA13
PA14: U1.41(PA14-SWCLK) ; port PA14
PA15: U1.42(PA15) ; port PA15
PB0: R3.1 SB5.1 U1.28(PB0) ; port PB0
PB1: R4.1 SB6.1 U1.29(PB1) ; port PB1
PB2: U1.19(PB2) ; port PB2
PB3: U1.43(PB3-SWO) ; port PB3
PB4: U1.44(PB4) ; port PB4
PB5: R2.1 U1.45(PB5) ; port PB5
PB6: U1.46(PB6) ; port PB6
PB7: U1.47(PB7) ; port PB7
PB8: U1.5(PB8) ; port PB8
PB9: U1.6(PB9) ; port PB9
PC14: SB10.1 ; port PC14
PC15: SB12.1 ; port PC15
PE4: R8.2 U1.30(PE4) ; port PE4
NetB1_2: B1.2 B1.4 R7.1
NetB2_2: B2.2 B2.4 R8.1
NetB3_2: B3.2 B3.4 R9.1
NetC3_2: C3.2 D1.1(A) U1.7(PB11-NRST)
NetC6_2: C6.2 SB10.2 U1.2(PC14-OSC32_IN) X2.1(X1)
NetC7_2: C7.2 SB12.2 U1.3(PC15-OSC32_OUT) X2.2(X2)
NetLD1_1: LD1.1 R2.2
NetLD2_1: LD2.1 R3.2
NetLD3_1: LD3.1 R4.2
NetR7_2: R7.2 SB11.1
NetU1_24: U1.24(OSC_OUT) X1.3
NetU1_25: U1.25(OSC_IN) X1.1

Not connected (* = marked no-connect by the designer): B1 5*; B2 5*; B3 5*; B4 5*

### Notes on the sheet
- A2
- A3
- D2
- D4
- D13
- A4
- A5
- A0
- A1
- D1
- SWO
- D10
- D12
- D8
- D5
- D11
- D6
- D0
- D14
- D15
- SWD reserved
- SWDIO
- SWCLK
- D9
- D3
- D7
- Reserved
- Production Test Pins
- Title:
- Project:
- Size:
- Revision:
- Variant:
- -
- Date:
- Reference:
- Sheet:
- of

### Library data of the parts
B1-B4 = MCD-01485: Microminiature Tact Switch for SMT - KMR 2 Series - 1.9 mm height; Part_Type: Misc; Manufacturer: C&K; Part_Preference: Recommended; Internal_Part_Number: MCD-01485; Status: Released; Manufacturer_Part_Number: KMR231GLFS; ComponentLink1URL: http://tunmcdsvn.tun.st.com/Component_Datasheet_Library/Trunk/Misc/C&K_tactile_switch_KMR_series
C3 = MCD-00006: as C41 on sheet STLINK_V2-1; Internal_Part_Number: MCD-00006; Status: Released; Part_Type: Capacitor; Package: C0402; ComponentLink1URL: http://tunmcdsvn.tun.st.com/Component_Datasheet_Library/Trunk/Capacitors/Yageo_Multilayer_Capacitor_X7R_series_100pF_to_22uF; Order_Code_Digikey: 311-1338-1-ND; Order_Code_Farnell: 9402047
C6 C7 = MCD-00015: Capacitor, MLCC, 10pF, 50V, NPO, +/-5%, 0402, T=0,5mm; Manufacturer_Part_Number: CC0402JRNPO9BN100; Manufacturer: YAGEO; Part_Preference: Recommended; Internal_Part_Number: MCD-00015; Status: Released; Part_Type: Capacitor; Package: C0402; ComponentLink1URL: http://tunmcdsvn.tun.st.com/Component_Datasheet_Library/Trunk/Capacitors/Yageo_Capacitor_NP0_16V-to-50V
CN3 = MCD-02060: Header, 5x1, 2,54mm, VR, TH, Height 5.84mm/2.54mm; Part_Type: Connector; Manufacturer_Part_Number: TSW-105-07-G-S; Manufacturer: SAMTEC; Part_Preference: Recommended; Order_Code_RS: 161-2268; Internal_Part_Number: MCD-02060; Value: Header 5x1; Status: Checked; ComponentLink1URL: http://tunmcdsvn.tun.st.com/Component_Datasheet_Library/Trunk/Connectors/Samtec_TSW-HTSW-series; Alternate_Manufacturer: N/A; Alternate_Manufacturer_Part_Number: N/A; Package: N/A; Order_Code_Digikey: SAM1029-05-ND; Order_Code_Farnell: 2856705
D1 = MCD-01677: Small signal Schottky diodes; Part_Type: Diode; Manufacturer: STMICROELECTRONICS; BMS_Part_Number: 9151123; Part_Preference: Recommended; Manufacturer_HQ_COO: EU; Internal_Part_Number: MCD-01677; Status: Checked; Manufacturer_Part_Number: BAT54KFILM; Package: SOD-523; ComponentLink1URL: http://tunmcdsvn.tun.st.com/Component_Datasheet_Library/Trunk/Diodes/STM_SCHOTTKY_DOUBLE_BAT54SWFILM/STM_SCHOTTKY_DOUBLE_BAT54SWFILM.pdf
LD1 = MCD-00584: LED Blue, 0603 SMD, 3.3 V Forward Voltage; Part_Type: Display; Manufacturer_Part_Number: VLMB1300-GS08; Manufacturer: VISHAY; Part_Preference: Recommended; Order_Code_RS: 7730430; Internal_Part_Number: MCD-00584; Status: Released; Package: LED 0603; ComponentLink1URL: http://tunmcdsvn.tun.st.com/Component_Datasheet_Library/Trunk/Display/VISHAY_LED_BLUE_VLMB1300-GS08; Order_Code_Digikey: VLMB1300-GS08CT-ND; Order_Code_Farnell: 2251459
LD2 = MCD-00589: as LD5 on sheet Power; Internal_Part_Number: MCD-00589; Status: Released; Package: LED 0603; ComponentLink1URL: http://tunmcdsvn.tun.st.com/Component_Datasheet_Library/Trunk/Display/VISHAY_LED_GREEN_VLMTG1300-GS08; Order_Code_Digikey: VLMTG1300-GS08CT-ND; Order_Code_Farnell: 2251490
LD3 = MCD-00587: LED Red, 0603 SMD, 2V Forward Voltage; Part_Type: Display; Manufacturer_Part_Number: VLMS1300-GS08; Manufacturer: VISHAY; Alternate_Manufacturer_Part_Number: LS Q976-NR-1; Alternate_Manufacturer: OSRAM OPTO SEMICONDUCTORS; Part_Preference: Recommended; Internal_Part_Number: MCD-00587; Status: Released; Package: LED 0603; ComponentLink1URL: http://tunmcdsvn.tun.st.com/Component_Datasheet_Library/Trunk/Display/VISHAY_LED_RED_VLMS1300-GS08; Order_Code_Digikey: VLMS1300-GS08CT-ND; Order_Code_Farnell: 2078728
R2-R4 = MCD-00507: Resistor,680R,0402,1%,1/16W; Manufacturer_Part_Number: RC0402FR-07680RL; Manufacturer: YAGEO; Part_Preference: Recommended; Internal_Part_Number: MCD-00507; Status: Released; Part_Type: Resistor; Package: R0402; ComponentLink1URL: http://tunmcdsvn.tun.st.com/Component_Datasheet_Library/Trunk/Resistors/Yageo_Resistor_RC0402-series; Order_Code_Digikey: 311-680LRCT-ND; Order_Code_Farnell: 9239219; Order_Code_RS: N/A
R6 = MCD-00053: as R16 on sheet STLINK_V2-1; Internal_Part_Number: MCD-00053; Status: Released; Part_Type: Resistor; Package: R0402; ComponentLink1URL: http://tunmcdsvn.tun.st.com/Component_Datasheet_Library/Trunk/Resistors/Yageo_Resistor_RC0402-series; Order_Code_Digikey: 311-10.0KLRCT-ND; Order_Code_Farnell: 9239359; Order_Code_RS: N/A
R7-R9 = MCD-00061: as R33 on sheet Arduino_Mopho_Connectors; Internal_Part_Number: MCD-00061; Status: Released; Part_Type: Resistor; Package: R0402; ComponentLink1URL: http://tunmcdsvn.tun.st.com/Component_Datasheet_Library/Trunk/Resistors/Yageo_Resistor_RC0402-series; Order_Code_Digikey: 311-1.00KLRCT-ND; Order_Code_Farnell: 9239235; Order_Code_RS: N/A
SB5 SB6 SB10-SB12 = MCD-01618: as SB28 on sheet STLINK_V2-1; Internal_Part_Number: MCD-01618; Status: Released; Package: SB0402; ComponentLink1URL: http://tunmcdsvn.tun.st.com/Component_Datasheet_Library/Trunk/Resistors/Yageo_Resistor_RC0402-series; Order_Code_Digikey: 311-0.0JRTR-ND; Order_Code_Farnell: 2363467
U1 = MCD-02058: Multiprotocol wireless 32-bit MCU ARM®-based Cortex®-M4 with FPU, Bluetooth® Low-Energy and 802.15.4 radio solution; Part_Type: IC; Manufacturer: STMICROELECTRONICS; Part_Preference: Recommended; Manufacturer_HQ_COO: EU; Component_Country_Of_Origin: China; Internal_Part_Number: MCD-02058; Status: Standby; Manufacturer_Part_Number: STM32WB15CCU6; Package: UFQFPN48; ComponentLink1URL: http://tunmcdsvn.tun.st.com/Component_Datasheet_Library/Trunk/IC/STM_MCU_STM32WB15CCU6; Alternate_Manufacturer: N/A; Alternate_Manufacturer_Part_Number: N/A; Order_Code_Digikey: N/A; Order_Code_Farnell: N/A; Order_Code_RS: N/A
X1 = MCD-01446: Crystal 32MHz, 8pF, +-10ppm, 60ohms max, SMD; Part_Type: Crystal oscillator; Manufacturer_Part_Number: NX2016SA 32MHz EXS00A-CS06654; Manufacturer: NDK; BMS_Part_Number: 9157042; Part_Preference: Recommended; Internal_Part_Number: MCD-01446; Status: Checked; Package: NX2016SA; ComponentLink1URL: http://tunmcdsvn.tun.st.com/Component_Datasheet_Library/Trunk/Crystal_Osc/NDK_NX2016SA 32MHz EXS00A-CS06654 (ESX10B-18811D)/NX2016SA 32MHz EXS00A-CS06654 (ESX10B-18811D).pdf; Order_Code_Digikey: 644-1373; Order_Code_Farnell: N/A; Order_Code_RS: N/A
X2 = MCD-01445: Crystal 32.768kHz, 7pF, +-20ppm, 80Kohms max, SMD; Part_Type: Crystal oscillator; Manufacturer_Part_Number: NX2012SA 32.768kHz EXS00A-MU00389; Manufacturer: NDK; BMS_Part_Number: 9157043; Part_Preference: Recommended; Internal_Part_Number: MCD-01445; Status: Checked; Package: NX2012SA; ComponentLink1URL: http://tunmcdsvn.tun.st.com/Component_Datasheet_Library/Trunk/Crystal_Osc/NDK_NX2012SA 32.768KHz EXS00A-MU00389/NX2012SA 32.768kHz EXS00A-MU00389 (EXS11B-04659).pdf; Order_Code_Digikey: 644-1350

## Nets that join several sheets
3V3: Power (5 pins), Arduino_Mopho_Connectors (CN6.2 CN6.4 CN7.12 CN7.16)
3V3_STLINK: Power (C22.2 C27.2 U5.5), STLINK_V2-1 (20 pins)
5V: Power (10 pins), STLINK_V2-1 (D2.1), Arduino_Mopho_Connectors (CN6.5 CN7.18)
5V_EXT: Power (JP1.1), Arduino_Mopho_Connectors (CN7.6)
5V_INT: Power (C10.1 JP1.3 U2.2 U2.4), Arduino_Mopho_Connectors (R33.2)
5V_USB_MCU: Power (JP1.5), Arduino_Mopho_Connectors (CN10.8)
5V_USB_STLINK: Power (9 pins), STLINK_V2-1 (C51.1 CN15.1 R16.2 U12.1)
AVDD: Power (SB25.1 SB26.1 SB27.1), Arduino_Mopho_Connectors (CN5.8 CN10.7)
GND: Power (39 pins), RF (19 pins), STLINK_V2-1 (42 pins), Arduino_Mopho_Connectors (9 pins), STM32_microcontroller_IOs (18 pins)
VBAT: Power (C28.1 SB19.2 SB20.2 U1.1), Arduino_Mopho_Connectors (CN7.33)
VDD: Power (JP2.2 JP3.1 JP6.1 SB26.2), RF (JP4.1), STLINK_V2-1 (JP5.11), Arduino_Mopho_Connectors (CN7.5)
VIN: Power (C8.2 C9.1 SB13.2 U2.3), Arduino_Mopho_Connectors (CN6.8 CN7.24)
BOOT0: Arduino_Mopho_Connectors (CN7.7), STM32_microcontroller_IOs (R6.2 U1.4)
NRST: STLINK_V2-1 (JP5.3), Arduino_Mopho_Connectors (CN6.3 CN7.14), STM32_microcontroller_IOs (B4.1 B4.3 D1.2)
PA0: Arduino_Mopho_Connectors (CN7.34 CN8.4), STM32_microcontroller_IOs (SB11.2 U1.9)
PA1: Arduino_Mopho_Connectors (CN7.32 CN8.3), STM32_microcontroller_IOs (U1.10)
PA2: Arduino_Mopho_Connectors (CN7.36 CN8.5), STM32_microcontroller_IOs (U1.11)
PA3: Arduino_Mopho_Connectors (CN7.38 CN8.6), STM32_microcontroller_IOs (U1.12)
PA4: Arduino_Mopho_Connectors (CN7.28 CN8.1), STM32_microcontroller_IOs (U1.13)
PA5: Arduino_Mopho_Connectors (CN5.6 CN10.11), STM32_microcontroller_IOs (U1.14)
PA6: Arduino_Mopho_Connectors (CN7.30 CN8.2), STM32_microcontroller_IOs (R9.2 U1.15)
PA7: Arduino_Mopho_Connectors (CN5.4 CN10.15), STM32_microcontroller_IOs (U1.16)
PA8: Arduino_Mopho_Connectors (CN9.7 CN10.25), STM32_microcontroller_IOs (U1.17)
PA9: STLINK_V2-1 (JP5.13), Arduino_Mopho_Connectors (CN10.12), STM32_microcontroller_IOs (U1.18)
PA10: STLINK_V2-1 (JP5.15), Arduino_Mopho_Connectors (CN10.14), STM32_microcontroller_IOs (U1.36)
PA11: Arduino_Mopho_Connectors (CN9.6 CN10.27), STM32_microcontroller_IOs (U1.37)
PA12: Arduino_Mopho_Connectors (CN9.4 CN10.31), STM32_microcontroller_IOs (U1.38)
PA13: STLINK_V2-1 (JP5.5), Arduino_Mopho_Connectors (CN7.13), STM32_microcontroller_IOs (U1.39)
PA14: STLINK_V2-1 (JP5.7), Arduino_Mopho_Connectors (CN7.15), STM32_microcontroller_IOs (U1.41)
PA15: Arduino_Mopho_Connectors (CN5.2 CN10.19), STM32_microcontroller_IOs (U1.42)
PB0: Arduino_Mopho_Connectors (CN9.3 CN10.33), STM32_microcontroller_IOs (R3.1 SB5.1 U1.28)
PB1: Arduino_Mopho_Connectors (CN9.5 CN10.29), STM32_microcontroller_IOs (R4.1 SB6.1 U1.29)
PB2: Arduino_Mopho_Connectors (CN5.3 CN10.17), STM32_microcontroller_IOs (U1.19)
PB3: STLINK_V2-1 (JP5.9), Arduino_Mopho_Connectors (CN10.30), STM32_microcontroller_IOs (U1.43)
PB4: Arduino_Mopho_Connectors (CN5.5 CN10.13), STM32_microcontroller_IOs (U1.44)
PB5: Arduino_Mopho_Connectors (CN5.1 CN10.21), STM32_microcontroller_IOs (R2.1 U1.45)
PB6: Arduino_Mopho_Connectors (CN9.2 CN10.35), STM32_microcontroller_IOs (U1.46)
PB7: Arduino_Mopho_Connectors (CN9.1 CN10.37), STM32_microcontroller_IOs (U1.47)
PB8: Arduino_Mopho_Connectors (CN5.10 CN10.3), STM32_microcontroller_IOs (U1.5)
PB9: Arduino_Mopho_Connectors (CN5.9 CN10.5), STM32_microcontroller_IOs (U1.6)
PC14: Arduino_Mopho_Connectors (CN7.25), STM32_microcontroller_IOs (SB10.1)
PC15: Arduino_Mopho_Connectors (CN7.27), STM32_microcontroller_IOs (SB12.1)
PE4: Arduino_Mopho_Connectors (CN9.8 CN10.23), STM32_microcontroller_IOs (R8.2 U1.30)
PWR_ENn: Power (R11.1 U4.4), STLINK_V2-1 (U8.28)

## Assembly variants
WB15CC: not fitted C36 C39 C40 CN2 CN3 CN4 CN13 CN14 J2 R5 R30 SB5 SB6 SB10 SB12 SB13 SB15 SB16 SB17 SB19 SB21 SB23 SB25 SB27 SB29 SB32